# EAGLE design attinier85-light-sensor-shield-mk-1.0 (EAGLE 6.5.0)
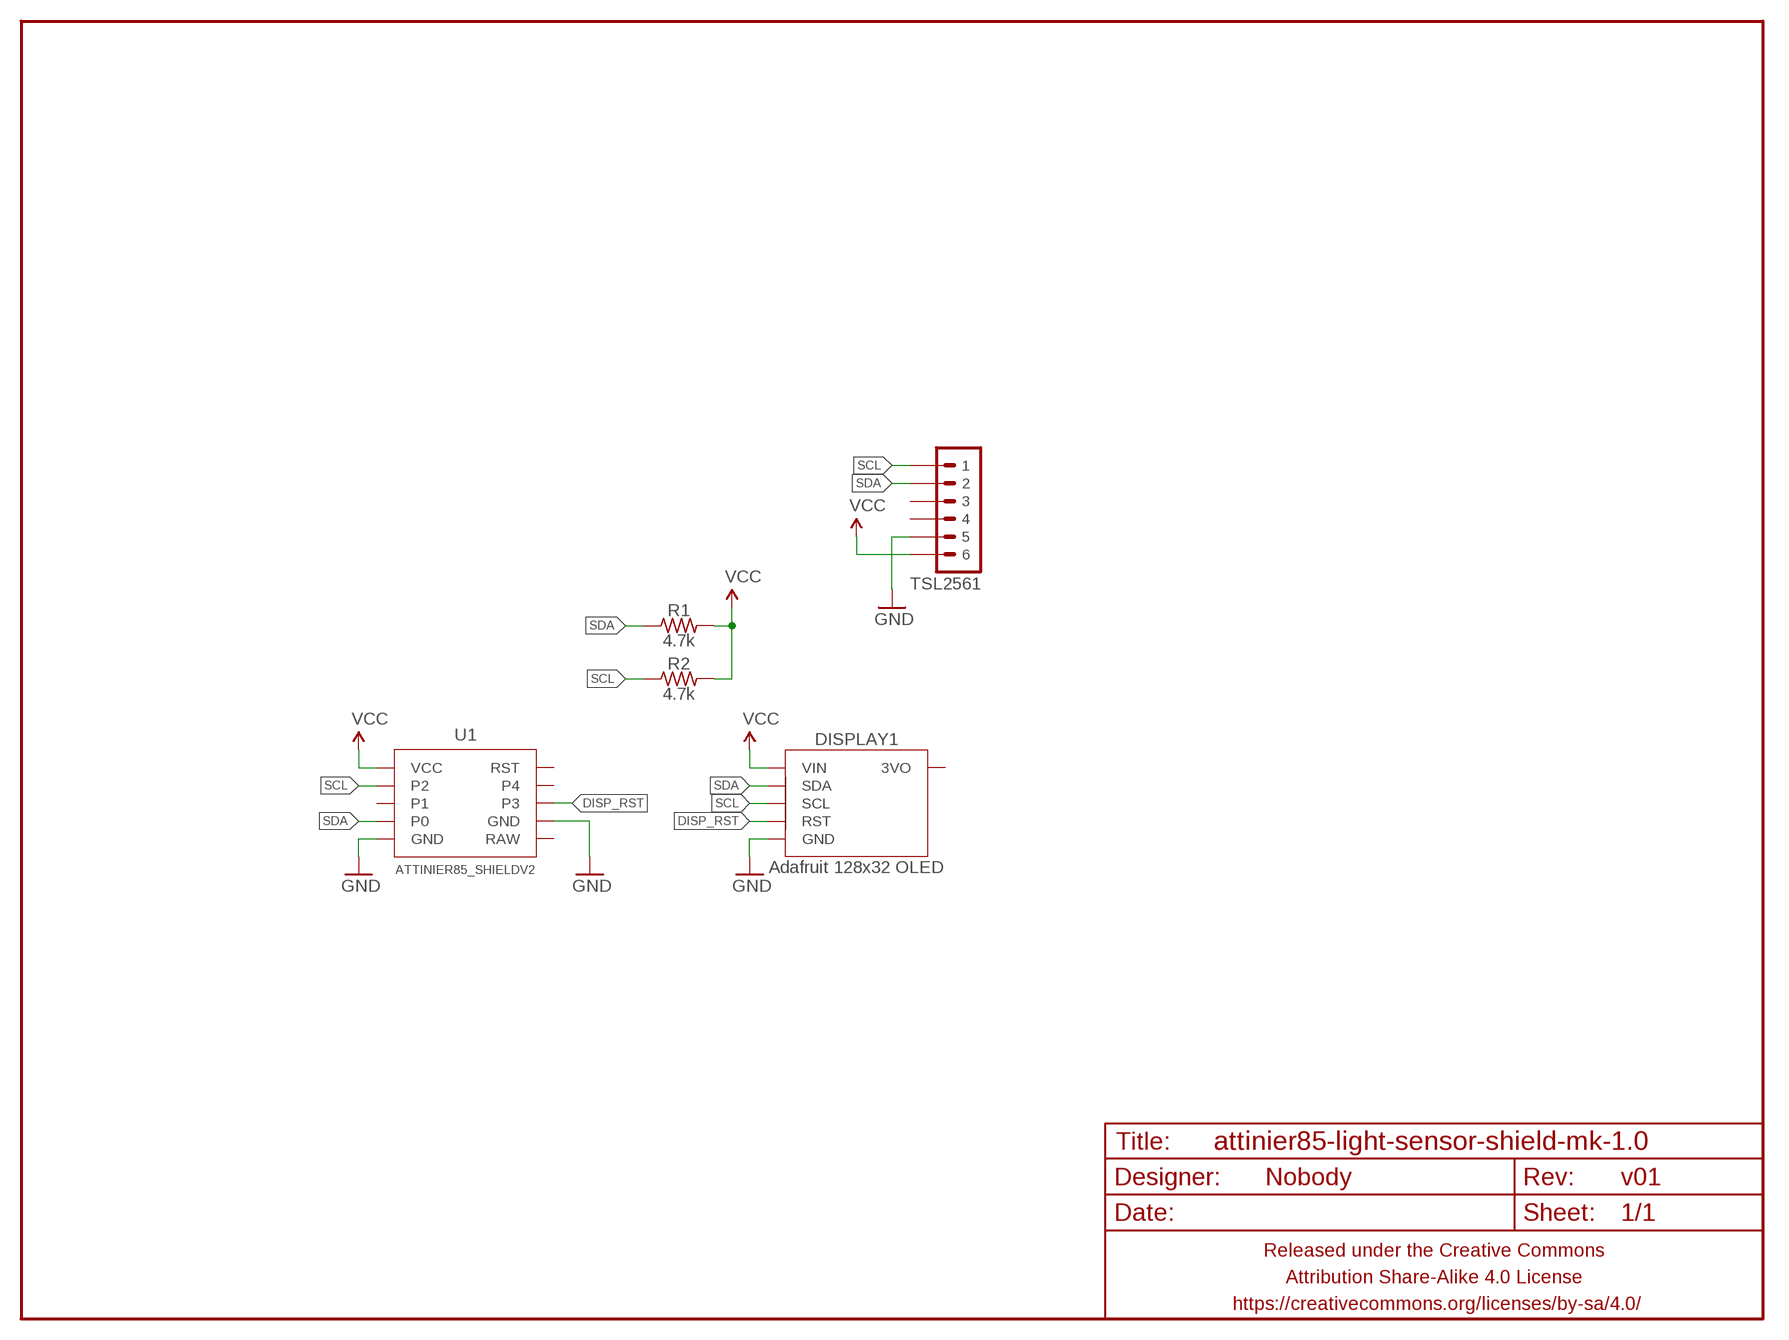
[diagram p0: schematic, sheet 1]

## Parts
DISPLAY1  Adafruit 128x32 OLED  ADAFRUIT_128X32_OLED_I2CNOHOLES  [ADAFRUIT_128X32_OLED_I2C_CLOSER_NOHOLES]
FRAME1  FRAME-LETTERNO_PACKAGE  [DUMMY]
R1  4.7k  RESISTORPTH-AXIAL-7.62MM  [RESISTOR-AXIAL-PTH-7.62MM]
R2  4.7k  RESISTORPTH-AXIAL-7.62MM  [RESISTOR-AXIAL-PTH-7.62MM]
TSL2561  M06CLOSER  [1X06_CLOSER]
U1  ATTINIER85_SHIELDV2  [ATTINIER85_SHIELD_V2]

## Nets
DISP_RST: DISPLAY1.RST U1.3
GND: DISPLAY1.GND TSL2561.5 U1.GND@1(GND) U1.GND@2(GND)
SCL: DISPLAY1.SCL R2.P$1 TSL2561.1 U1.2
SDA: DISPLAY1.SDA R1.P$1 TSL2561.2 U1.0
VCC: DISPLAY1.VIN R1.P$2 R2.P$2 TSL2561.6 U1.VCC
Unconnected: DISPLAY1.3VO TSL2561.3 TSL2561.4 U1.1 U1.4 U1.RAW U1.RST

## Library data of the parts
DISPLAY1 = A_butts:ADAFRUIT_128X32_OLED_I2C
FRAME1 = A_butts:FRAME-LETTER: Schematic Frame Standard 8.5x11 US Letter frame; DESIGNER: Nobody; VERSION: v01
R1 R2 = A_butts:RESISTOR: RESISTOR, American symbol
TSL2561 = A_butts:M06: Header 6 Standard 6-pin 0.1" header. Use with straight break away headers (SKU : PRT-00116), right angle break away headers (PRT-00553), swiss pins (PRT-00743), machine pins (PRT-00117), and female headers (PRT-00115). Molex polarized connector foot print use with SKU : PRT-08094 with associated crimp pins and housings. NOTES ON THE VARIANTS LOCK and LOCK_LONGPADS... This footprint was designed to help hold the alignment of a through-hole component (i.e. 6-pin header) while soldering it into place. You may notice that each hole has been shifted either up or down by 0.005 of an inch from it's more standard position (which is a perfectly straight line). This slight alteration caused the pins (the squares in the middle) to touch the edges of the holes. Because they are alternating, it causes a "brace" to hold the component in place. 0.005 has proven to be the perfect amount of "off-center" position when using our standard breakaway headers. Although looks a little odd when you look at the bare footprint, once you have a header in there, the alteration is very hard to notice. Also,if you push a header all the way into place, it is covered up entirely on the bottom side. This idea of altering the position of holes to aid alignment will be further integrated into the Sparkfun Library for other footprints. It can help hold any component with 3 or more connection pins.
U1 = A_butts:ATTINIER85_SHIELD

## Board
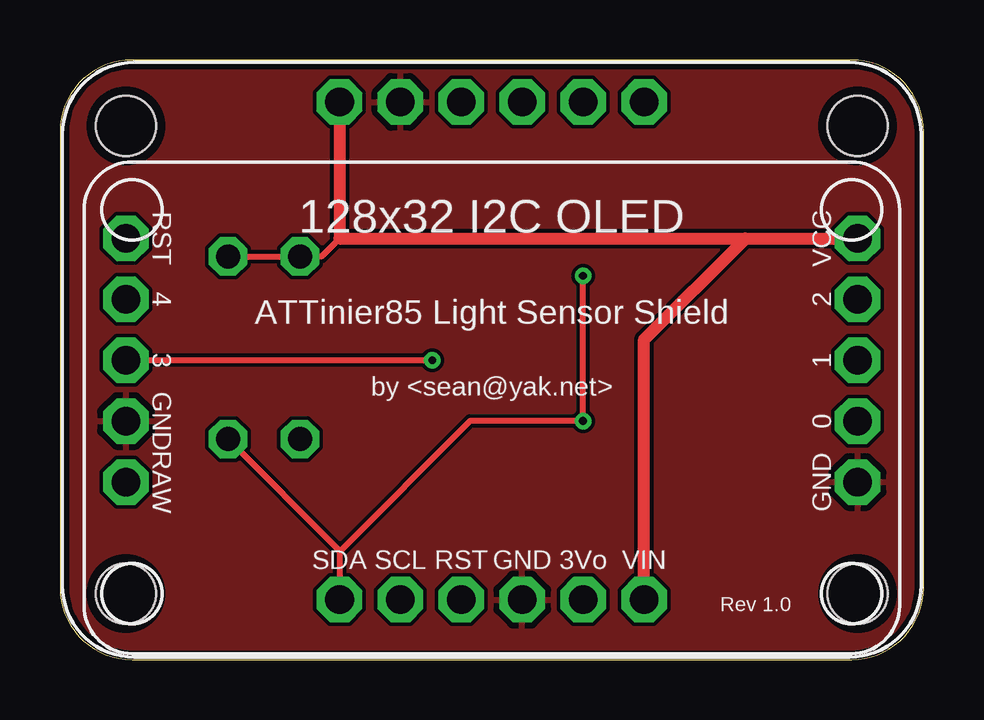
[diagram p1: board, top side]
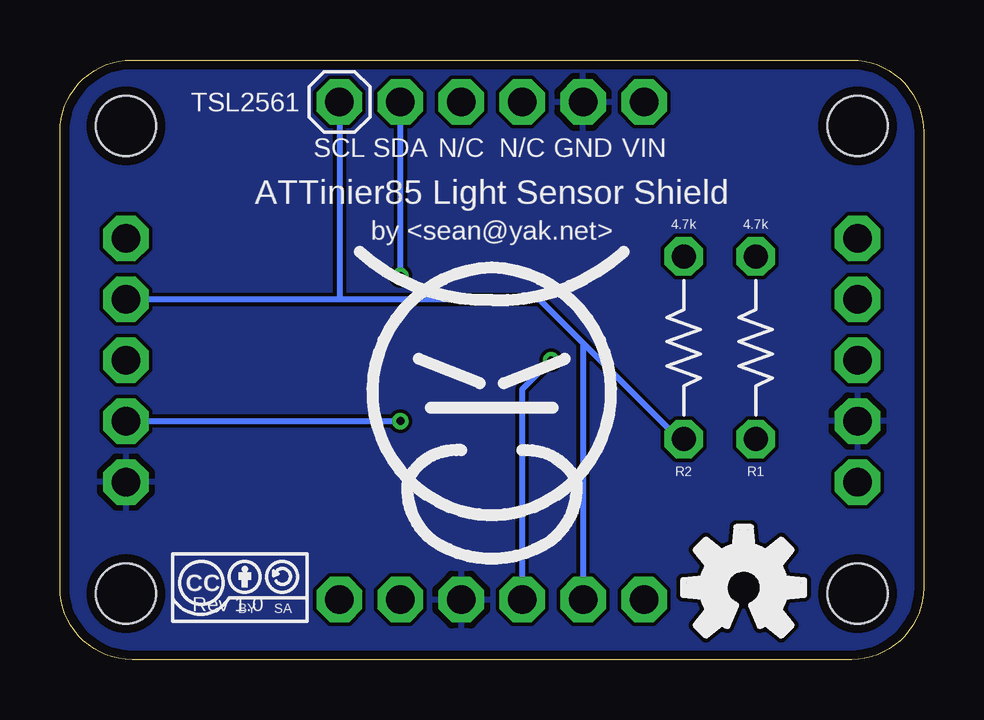
[diagram p2: board, bottom side, seen from below]

Size 36 x 25 mm. Coordinates in mm from the lower left corner, seen from the top.
Outline: 0,22 0,3 arc90 3,0 33,0 arc90 36,3 36,22 arc90 33,25 3,25 arc90 0,22
Copper layers (1*16): Top 0.0356mm / dielectric 1.5011mm / Bottom 0.0356mm
Design rules "LaenPCBOrder_2": minimum track width 6mil, minimum drill 13mil, track to track 6mil, track to pad 6mil, pad to pad 6mil, via to via 6mil, smd to smd 6mil, copper to edge 15mil, drill to drill 6mil, minimum pad ring 7mil, minimum via ring 7mil, stop-mask expansion 3mil, vias tented up to drill 20mil, thermal gap 10mil

### Footprints (pad centres in the part's own frame; a part is rotated, then mirrored left to right if it is on the bottom)
ADAFRUIT_128X32_OLED_I2C_CLOSER_NOHOLES = drill 1.2 pad 1.9 octagon: 3VO 3.81,0; GND 1.27,0; RST -1.27,0; SCL -3.81,0; SDA -6.35,0; VIN 6.35,0
RESISTOR-AXIAL-PTH-7.62MM = drill 1 pad 1.6 octagon: P$1 -3.81,0; P$2 3.81,0
1X06_CLOSER = drill 1.2 pad 1.9 octagon: 1 -6.35,0; 2 -3.81,0; 3 -1.27,0; 4 1.27,0; 5 3.81,0; 6 6.35,0
ATTINIER85_SHIELD_V2 = drill 1.2 pad 1.9 octagon: 0 15.25,-2.56; 1 15.25,-0.02; 2 15.25,2.52; 3 -15.25,-0.02; 4 -15.25,2.52; GND@1 -15.25,-2.56; GND@2 15.25,-5.1; RAW -15.25,-5.1; RST -15.25,5.06; VCC 15.25,5.06 | hole 2.5: -15.25,-9.75; -15.25,9.75; 15.25,9.75; 15.25,-9.75

### Placement (x,y rotation side)
DISPLAY1  18,2.5 0 top
FRAME1  0,0 0 top
R1  7,13 90 bottom
R2  10,13 90 bottom
TSL2561  18,23.25 0 bottom
U1  18,12.5 0 top
U$1  [COW]  18,10 0 bottom
U$2  [CC-BY-SA-4.0-NO-URL]  28.5,3 0 bottom
U$3  [OSHWLOGO_TOP_0.2]  7.5,3 0 bottom

### Tracks (layer width: path | path; a pad name or v marks a point on that pad's centre or on a via)
DISP_RST  (via drill 0.33)
  Top 0.25: U1.3 v15.52,12.48
  Bottom 0.25: v15.52,12.48 16.73,11.27 DISPLAY1.RST
GND
  pour Top: -0.1,-0.1 -0.1,25.1 36.1,25.1 36.1,-0.1
  pour Bottom: -0.1,-0.1 -0.1,25.1 36.1,25.1 36.1,-0.1
SCL
  Bottom 0.25: 14.19,13.19 16.02,15.02 24.35,15.02 | 14.19,13.19 DISPLAY1.SCL | 14.19,13.19 10.19,9.19 R2.P$1 | 24.35,15.02 U1.2 | TSL2561.1 24.35,15.02
SDA  (via drill 0.33)
  Top 0.25: R1.P$1 11.65,4.54 11.65,4.5 | 11.65,4.5 DISPLAY1.SDA | 11.65,4.5 17.09,9.94 v21.81,9.94 v21.81,16
  Bottom 0.25: U1.0 v21.81,9.94 | v21.81,16 TSL2561.2
VCC
  Top 0.25: R1.P$2 R2.P$2 10.9,16.81 11.65,17.56 | 27.81,16.81 28.5,17.5
  Top 0.5: DISPLAY1.VIN 24.35,13.35 28.5,17.5 28.56,17.56 | 28.56,17.56 U1.VCC | 28.56,17.56 11.65,17.56 TSL2561.6

### Text on the board
bPlace: VIN | GND | N/C | N/C | SDA | SCL